# Altium project NANORACK_LASER.PrjPcb
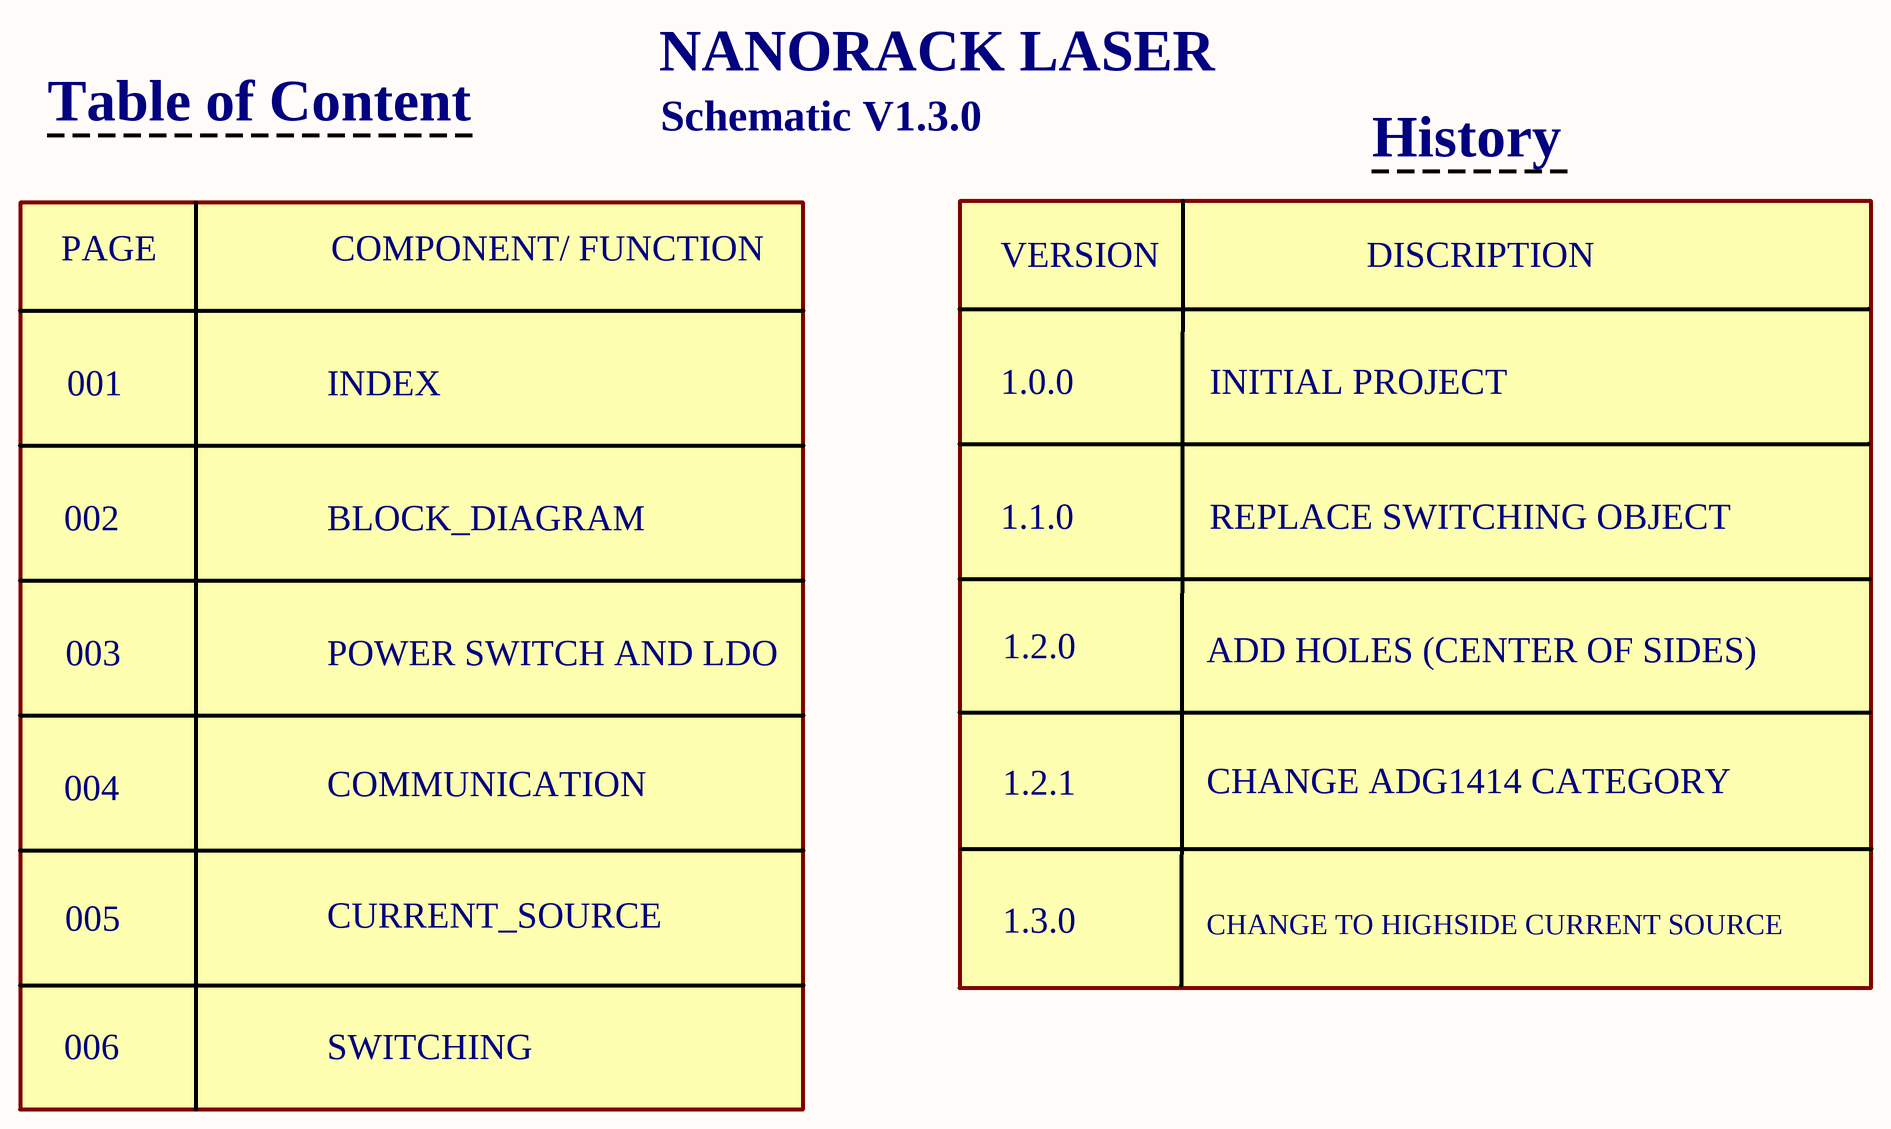
[diagram p0: INDEX.SchDoc]
6 sheets, 200 parts. Net scope: global (net labels, ports and power ports of the same name join across sheets).
Board files: LASERDIODE_V1.3.0.PcbDoc, REFERENCE.PcbDoc
Sheets:
  INDEX.SchDoc
  BLOCK_DIAGRAM.SchDoc
  POWER SWITCH AND LDO.SchDoc
  COMMUNICATION.SchDoc
  CURRENT_SOURCE.SchDoc
  SWITCHING.SchDoc

## Sheet INDEX.SchDoc
size 420 x 297 mm; SheetNumber: 1; SheetTotal: 6

### Notes on the sheet
- NANORACK LASER
- Table of Content
- Schematic V1.3.0
- History
- PAGE
- COMPONENT/ FUNCTION
- VERSION
- DISCRIPTION
- 001
- INDEX
- 1.0.0
- INITIAL PROJECT
- 002
- BLOCK_DIAGRAM
- 1.1.0
- REPLACE SWITCHING OBJECT
- 003
- POWER SWITCH AND LDO
- 1.2.0
- ADD HOLES (CENTER OF SIDES)
- 004
- COMMUNICATION
- 1.2.1
- CHANGE ADG1414 CATEGORY
- 005
- CURRENT_SOURCE
- 1.3.0
- CHANGE TO HIGHSIDE CURRENT SOURCE
- 006
- SWITCHING
- Project:
- BEE-PC1
- Sub-system:
- Design by:
- Hung Nguyen D.
- Bao Bui Q.
- Sheet title:
- Sheet
- A3
- of
- Checked by:
- Approved by:
- Vu Pham
- Revision:
- Document No:
- V1.3.0
- Size:
- Date:

## Sheet BLOCK_DIAGRAM.SchDoc
size 420 x 297 mm; SheetNumber: 2; SheetTotal: 6

### Notes on the sheet
- Project:
- BEE-PC1
- Sub-system:
- Design by:
- Hung Nguyen D.
- Bao Bui Q.
- Sheet title:
- Sheet
- A3
- of
- Checked by:
- Approved by:
- Vu Pham
- Revision:
- Document No:
- V1.3.0
- Size:
- Date:
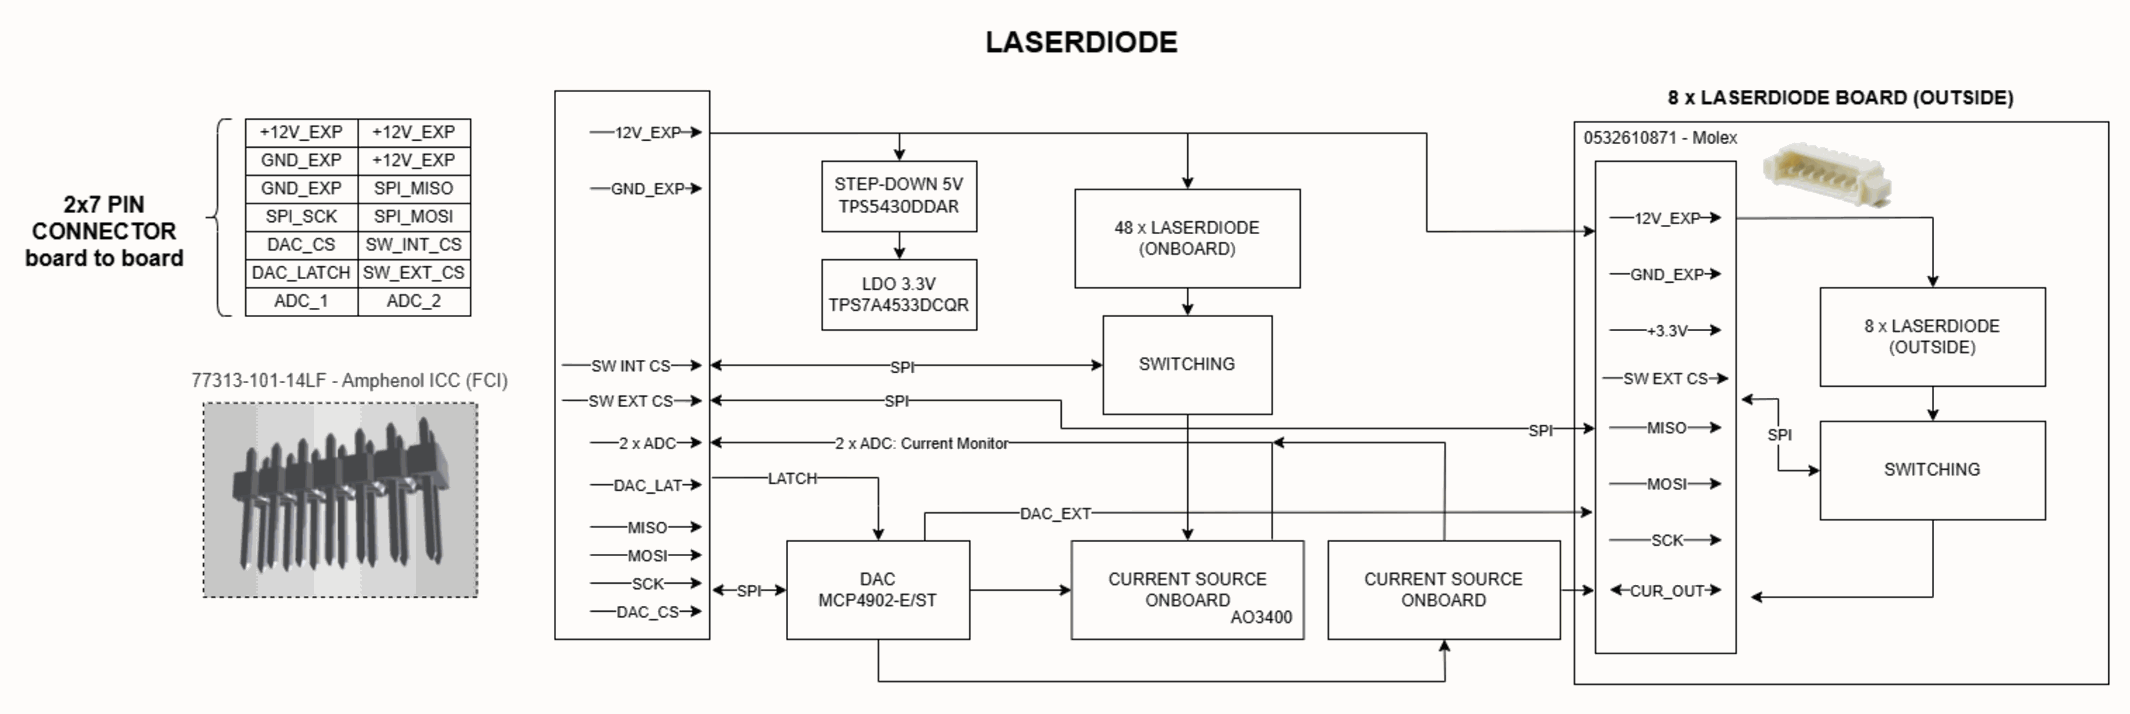
[diagram p1: BLOCK_DIAGRAM.SchDoc]

## Sheet POWER SWITCH AND LDO.SchDoc
size 420 x 297 mm; SheetNumber: 3; SheetTotal: 6
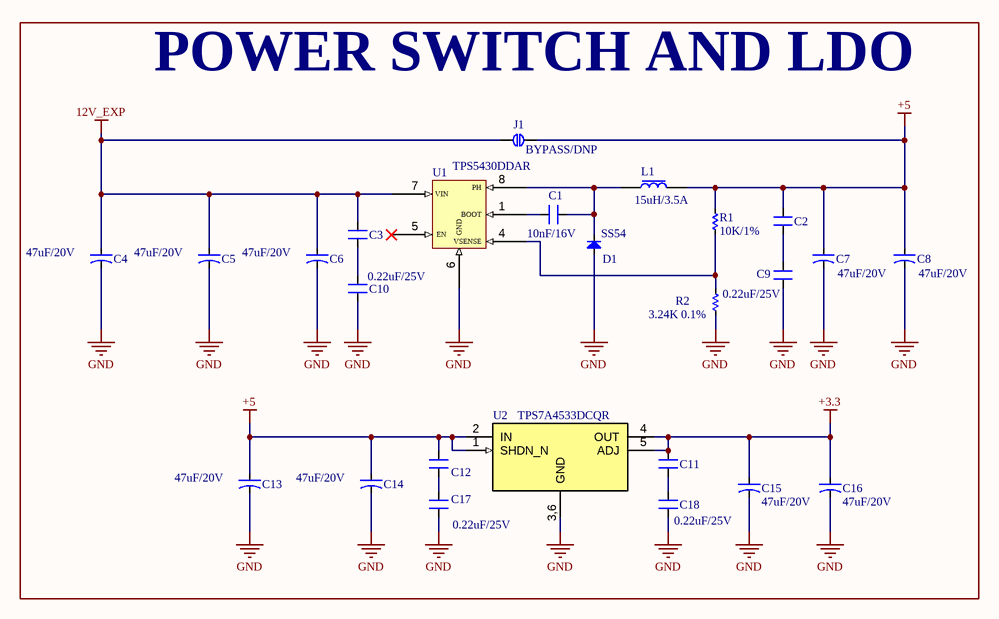
[diagram p2: POWER SWITCH AND LDO.SchDoc]

### Parts
C1  10nF/16V  [SM-0603]
C2  0.22uF/25V  [SM-0603]  (value not drawn)
C3  0.22uF/25V  [SM-0603]  (value not drawn)
C4  47uF/20V  [CAP TANT 2312]
C5  47uF/20V  [CAP TANT 2312]
C6  47uF/20V  [CAP TANT 2312]
C7  47uF/20V  [CAP TANT 2312]
C8  47uF/20V  [CAP TANT 2312]
C9  0.22uF/25V  [SM-0603]
C10  0.22uF/25V  [SM-0603]
C11  0.22uF/25V  [SM-0603]  (value not drawn)
C12  0.22uF/25V  [SM-0603]
C13  47uF/20V  [CAP TANT 2312]
C14  47uF/20V  [CAP TANT 2312]
C15  47uF/20V  [CAP TANT 2312]
C16  47uF/20V  [CAP TANT 2312]
C17  0.22uF/25V  [SM-0603]  (value not drawn)
C18  0.22uF/25V  [SM-0603]
D1  SS54  [DIO-SMD-A]
J1  BYPASS/DNP  [BIG_CONNECTOR]
L1  15uH/3.5A  [SRP7050TA]
R1  10K/1%  [RES-SMD-0603]
R2  3.24K 0.1%  [RES-SMD-0603]
U1  TPS5430DDAR  [HSOP8]
U2  TPS7A4533DCQR  [SOT223-6]

### Blocks framed on the sheet
POWER SWITCH AND LDO: C1-C18 D1 J1 L1 R1 R2 U1 U2

### Nets
12V_EXP: C3.2 C4.1 C5.1 C6.1 J1.1 U1.7(VIN)
+3.3: C11.2 C15.1 C16.1 U2.4(OUT) U2.5(ADJ)
+5: C2.2 C7.1 C8.1 C12.2 C13.1 C14.1 J1.2 L1.2 R1.2 U2.1(SHDN_N) U2.2(IN)
GND: C4.2 C5.2 C6.2 C7.2 C8.2 C9.1 C10.1 C13.2 C14.2 C15.2 C16.2 C17.1 C18.1 D1.1(A) R2.1 U1.6(GND) U2.3,6(GND)
NetC1_1: C1.1 D1.2(K) L1.1 U1.8(PH)
NetC1_2: C1.2 U1.1(BOOT)
NetC2_1: C2.1 C9.2
NetC3_1: C3.1 C10.2
NetC11_1: C11.1 C18.2
NetC12_1: C12.1 C17.2
NetR1_1: R1.1 R2.2 U1.4(VSENSE)

Not connected (* = marked no-connect by the designer): U1 5(EN)*

### Notes on the sheet
- Project:
- BEE-PC1
- Sub-system:
- Design by:
- Hung Nguyen D.
- Bao Bui Q.
- Sheet title:
- Sheet
- A3
- of
- Checked by:
- Approved by:
- Vu Pham
- Revision:
- Document No:
- V1.3.0
- Size:
- Date:

### Library data of the parts
C1 = CM: CL10B103KB8NNNC; Value: 103
C2 C3 C9-C12 C17 C18 = CM: CL10B224KA8NNNC; Value: 103
C4-C8 C13-C16 = CN-ALU-SMD: TAJC476K020RNJ; Published: 8-Jun-2000; LatestRevisionDate: 17-Jul-2002; LatestRevisionNote: Re-released for DXP Platform.; PackageReference: POLAR0.8; Publisher: Altium Limited
D1 = Diode SMD: Code - JEDEC: DO-214-AB; Value: 1N5007; Published: 8-Jun-2000; Revision: July-2002: Re-released for DXP Platform.; Publisher: Altium Limited
J1 = CNT: DNP
L1 = INDUCTOR: SRP7050TA-150M
R1 = Res-SMD: ERJ-3EKF1002V; Manufacturer: Generic Components; Class: Passive; Published: 08/06/2000; Publisher: Altium Hobart Technology Centre
R2 = Res-SMD: ERJ-3EKF3241V; Manufacturer: Generic Components; Class: Passive; Published: 08/06/2000; Publisher: Altium Hobart Technology Centre
U1 = TPS543X: pin to pad: 6>6+9

## Sheet COMMUNICATION.SchDoc
size 420 x 297 mm; SheetNumber: 4; SheetTotal: 6
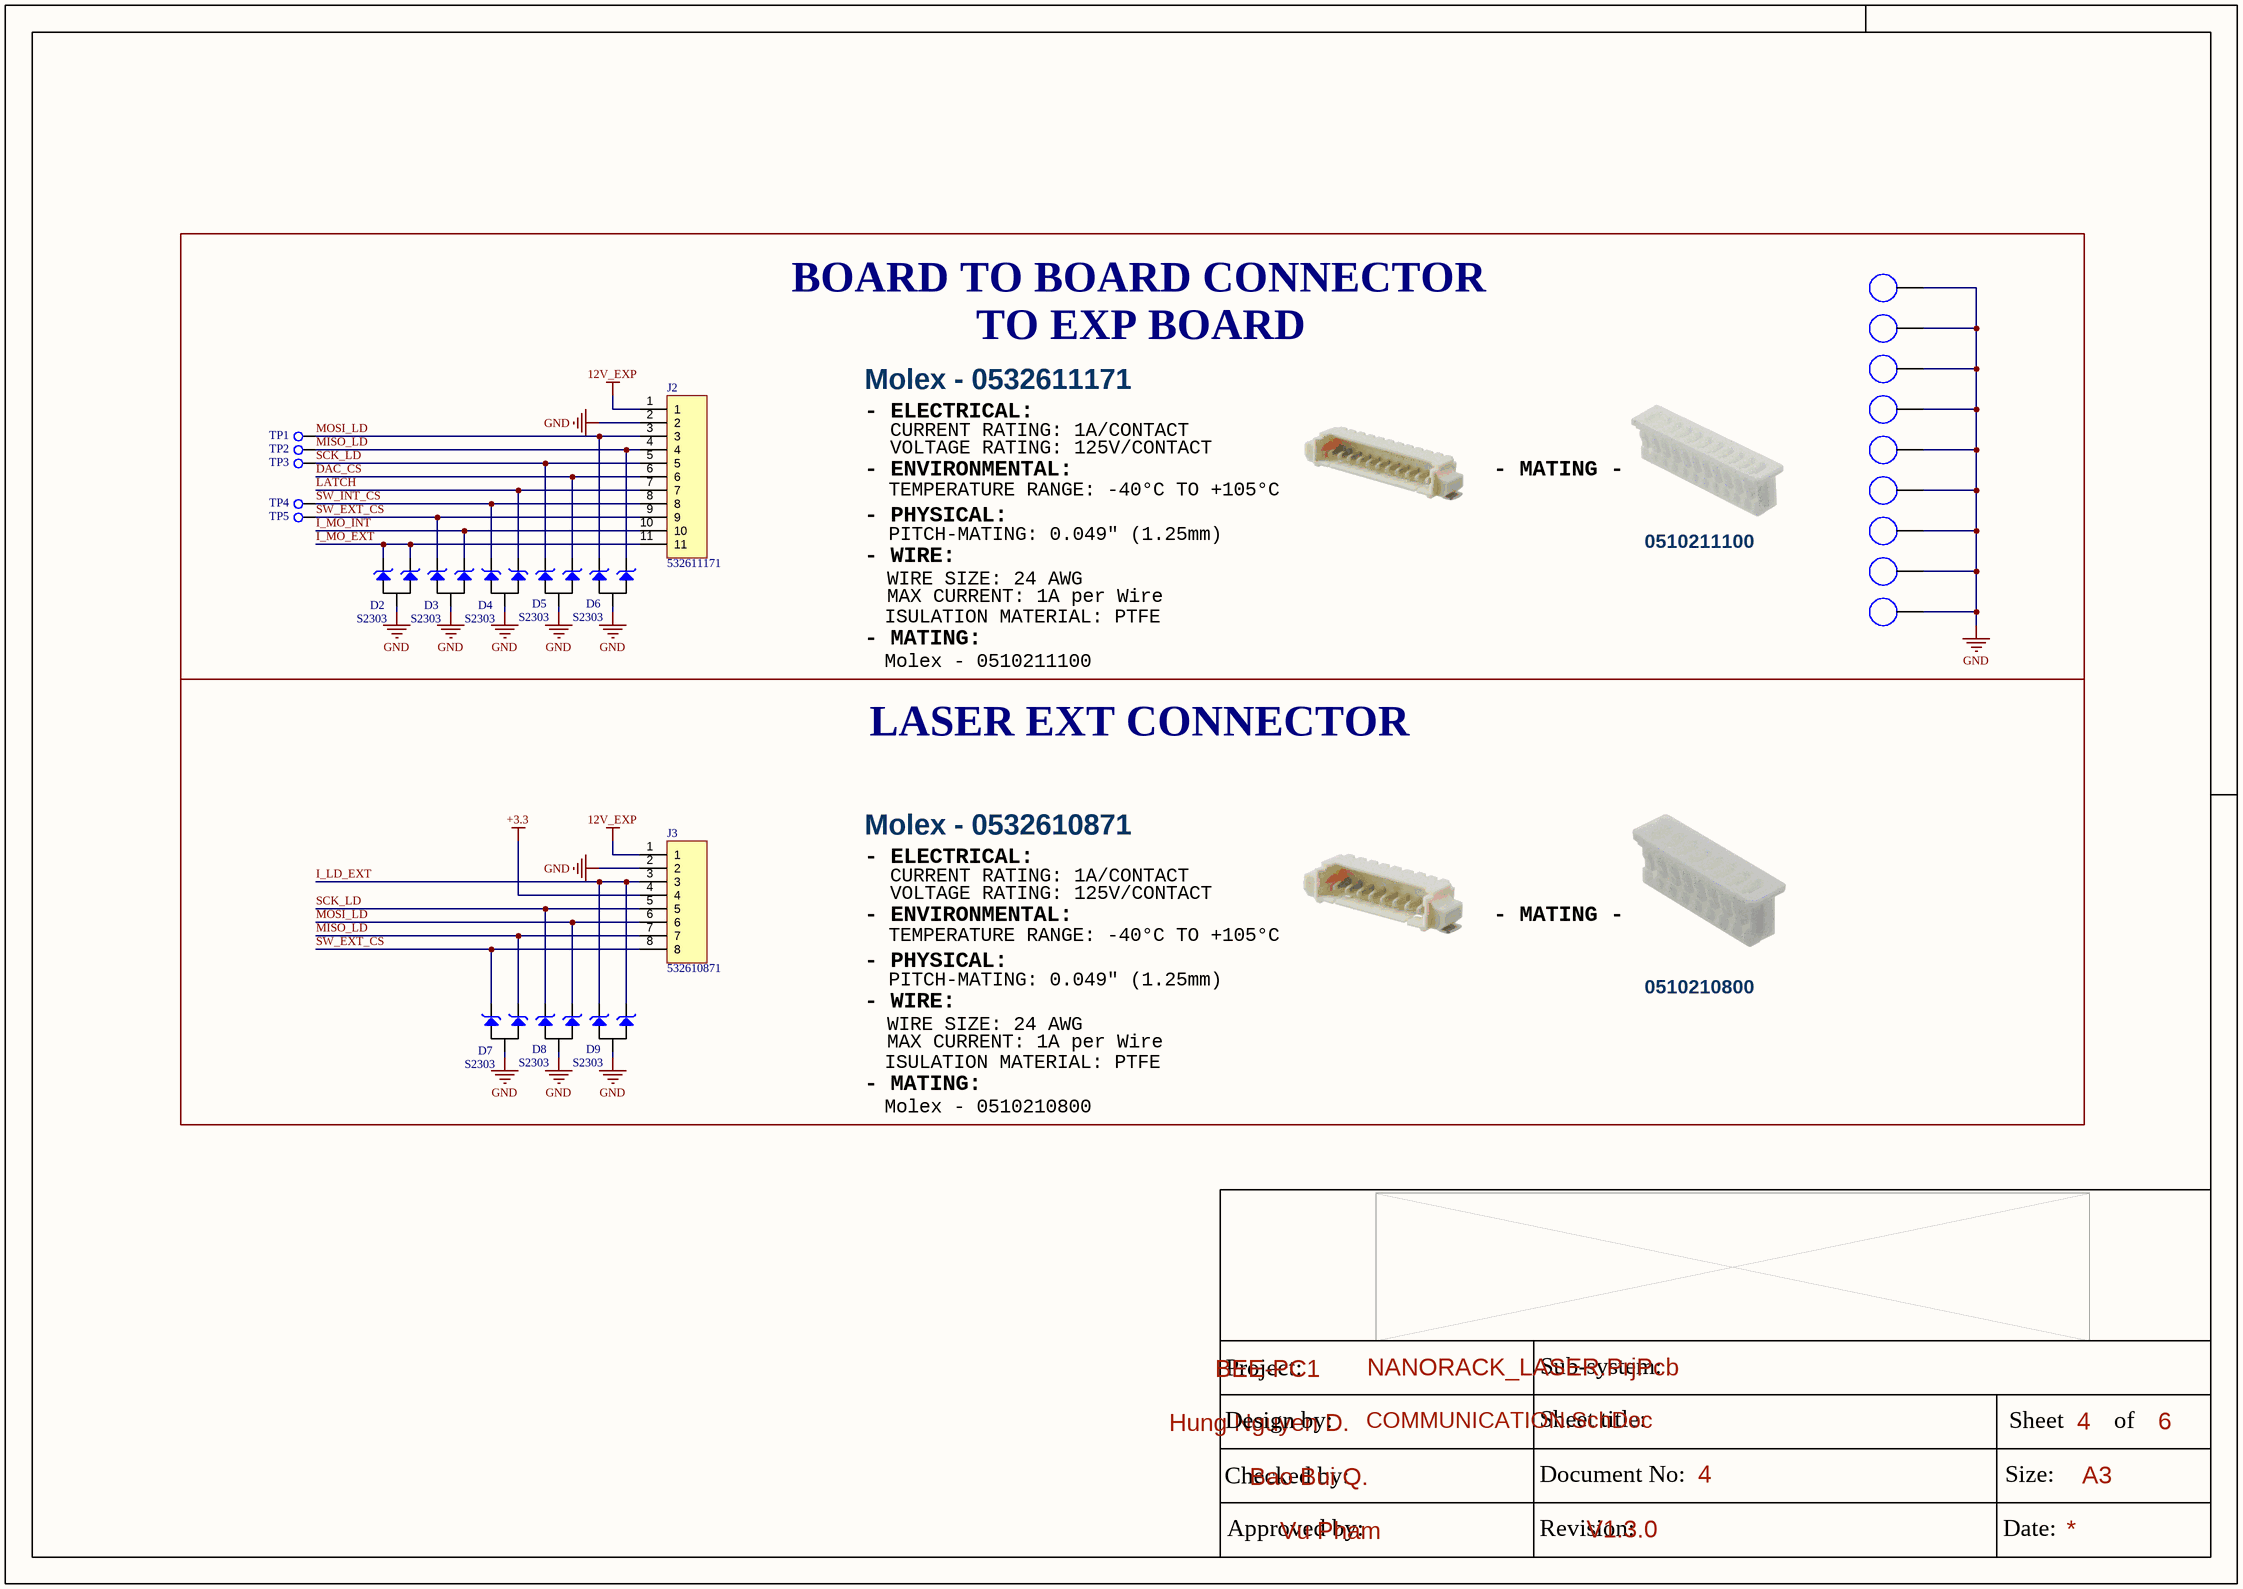
[diagram p3: COMMUNICATION.SchDoc]

### Parts
D2  S2303  [SOT23-123]
D3  S2303  [SOT23-123]
D4  S2303  [SOT23-123]
D5  S2303  [SOT23-123]
D6  S2303  [SOT23-123]
D7  S2303  [SOT23-123]
D8  S2303  [SOT23-123]
D9  S2303  [SOT23-123]
H1  HOLD  [M3]  (value not drawn)
H2  HOLD  [M3]  (value not drawn)
H3  HOLD  [M3]  (value not drawn)
H4  HOLD  [M3]  (value not drawn)
H5  HOLD  [M3]  (value not drawn)
H6  HOLD  [M3]  (value not drawn)
H7  HOLD  [M3]  (value not drawn)
H8  HOLD  [M3]  (value not drawn)
H9  HOLD  [M3]  (value not drawn)
J2  532611171  [MOLEX_532611171]
J3  532610871  [MOLEX_532610001]
TP1  Test_Point  [TESTPOINT]  (value not drawn)
TP2  Test_Point  [TESTPOINT]  (value not drawn)
TP3  Test_Point  [TESTPOINT]  (value not drawn)
TP4  Test_Point  [TESTPOINT]  (value not drawn)
TP5  Test_Point  [TESTPOINT]  (value not drawn)

### Blocks framed on the sheet
LASER EXT CONNECTOR: D7-D9 J3

### Nets
12V_EXP: J2.1 J3.1
+3.3: J3.4
GND: D2.2 D3.2 D4.2 D5.2 D6.2 D7.2 D8.2 D9.2 H1.1 H2.1 H3.1 H4.1 H5.1 H6.1 H7.1 H8.1 H9.1 J2.2 J3.2
I_LD_EXT: D9.1 D9.3 J3.3
DAC_CS: D5.3 J2.6
I_MO_EXT: D2.1 D2.3 J2.11
I_MO_INT: D3.3 J2.10
LATCH: D4.1 J2.7
MISO_LD: D6.3 D7.1 J2.4 J3.7 TP2.1
MOSI_LD: D6.1 D8.3 J2.3 J3.6 TP1.1
SCK_LD: D5.1 D8.1 J2.5 J3.5 TP3.1
SW_EXT_CS: D3.1 D7.3 J2.9 J3.8 TP5.1
SW_INT_CS: D4.3 J2.8 TP4.1

### Notes on the sheet
- BOARD TO BOARD CONNECTOR
- Molex - 0532611171
- TO EXP BOARD
- - ELECTRICAL:
- CURRENT RATING: 1A/CONTACT
- VOLTAGE RATING: 125V/CONTACT
- - ENVIRONMENTAL:
- - PHYSICAL:
- TEMPERATURE RANGE: -40°C TO +105°C
- - MATING -
- - WIRE:
- WIRE SIZE: 24 AWG
- PITCH-MATING: 0.049" (1.25mm)
- 0510211100
- - MATING:
- ISULATION MATERIAL: PTFE
- Molex - 0510211100
- MAX CURRENT: 1A per Wire
- Molex - 0532610871
- 0510210800
- Molex - 0510210800
- Project:
- BEE-PC1
- Sub-system:
- Design by:
- Hung Nguyen D.
- Bao Bui Q.
- Sheet title:
- Sheet
- A3
- of
- Checked by:
- Approved by:
- Vu Pham
- Revision:
- Document No:
- V1.3.0
- Size:
- Date:

### Library data of the parts
H1-H9 = PAD_HOLD
J2 = 532611171: Manufacturer_Name: Molex Connector Corporation; Copyright: Copyright (C) 2025 Ultra Librarian. All rights reserved.; Manufacturer_Part_Number: 532611171; Datasheet: https://www.molex.com/en-us/products/part-detail-pdf/532611171?display=pdf; RefDes: RefDes; Type: Type
J3 = 532610871: Manufacturer_Name: Molex Connector Corporation; Copyright: Copyright (C) 2025 Ultra Librarian. All rights reserved.; Manufacturer_Part_Number: 532610871; Datasheet: https://www.molex.com/en-us/products/part-detail-pdf/532610871?display=pdf; RefDes: RefDes; Type: Type

## Sheet CURRENT_SOURCE.SchDoc
size 420 x 297 mm; SheetNumber: 5; SheetTotal: 6
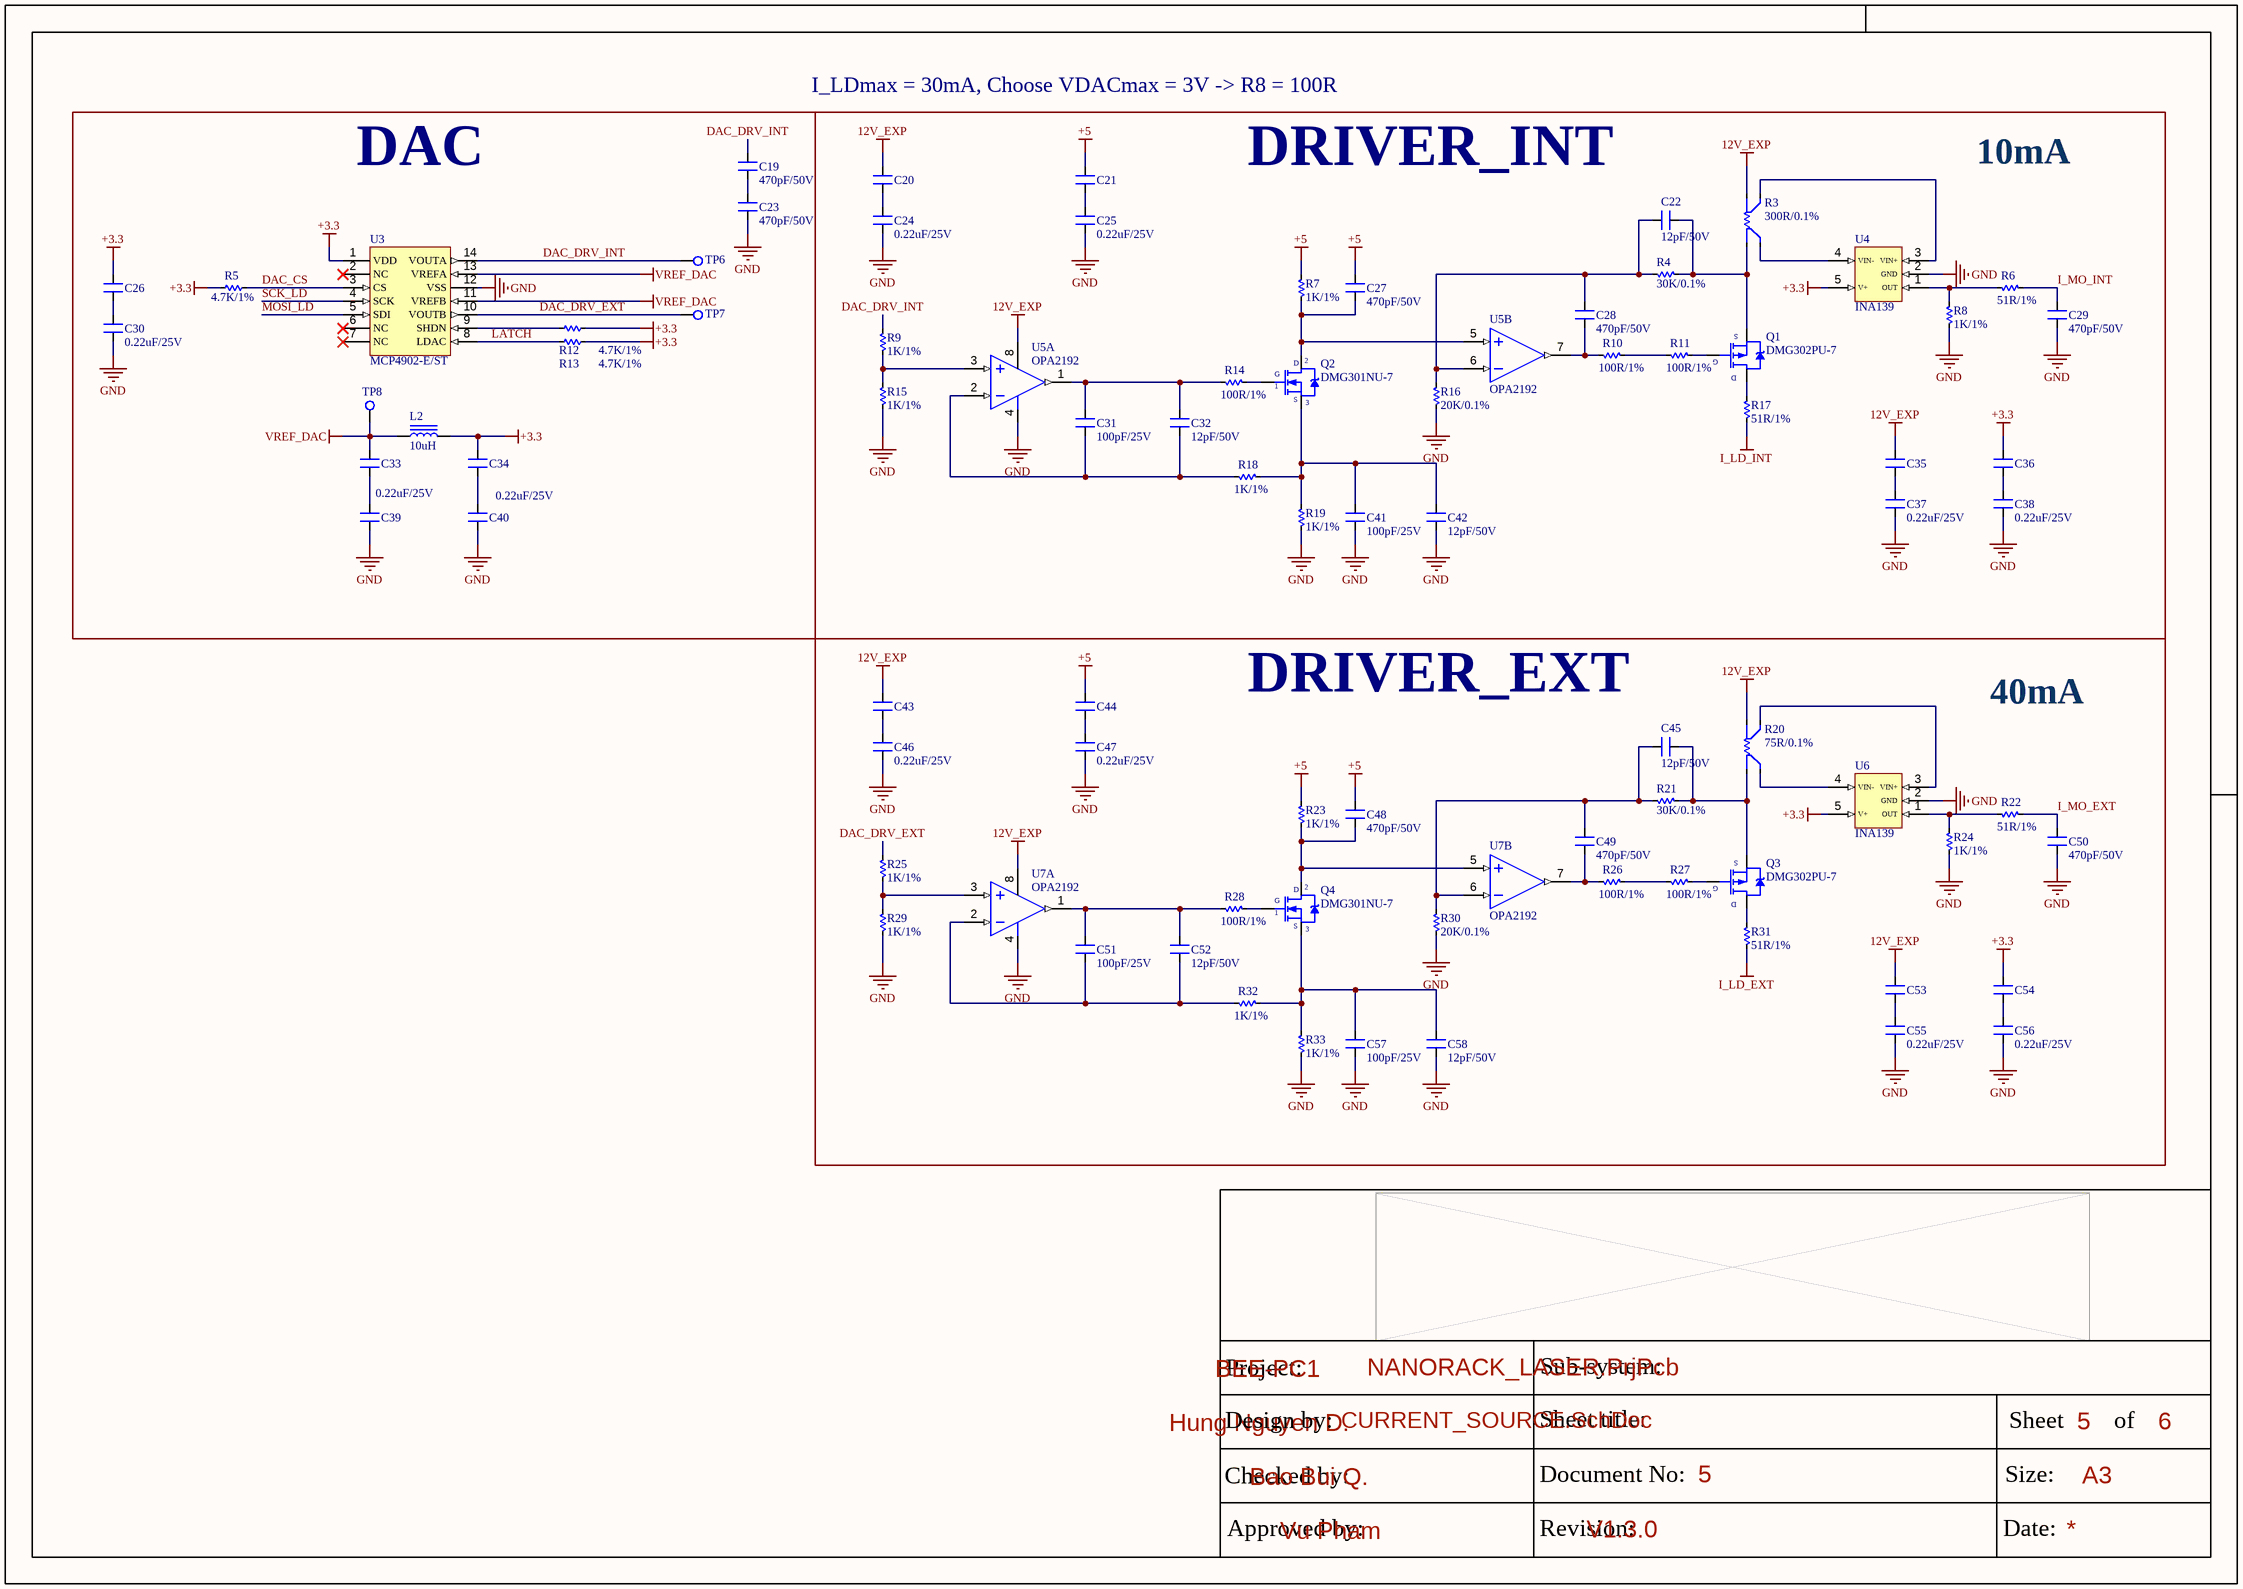
[diagram p4: CURRENT_SOURCE.SchDoc]

### Parts
C19  470pF/50V  [SM-0603]
C20  0.22uF/25V  [SM-0603]  (value not drawn)
C21  0.22uF/25V  [SM-0603]  (value not drawn)
C22  12pF/50V  [SM-0603]
C23  470pF/50V  [SM-0603]
C24  0.22uF/25V  [SM-0603]
C25  0.22uF/25V  [SM-0603]
C26  0.22uF/25V  [SM-0603]  (value not drawn)
C27  470pF/50V  [SM-0603]
C28  470pF/50V  [SM-0603]
C29  470pF/50V  [SM-0603]
C30  0.22uF/25V  [SM-0603]
C31  100pF/25V  [SM-0603]
C32  12pF/50V  [SM-0603]
C33  0.22uF/25V  [SM-0603]  (value not drawn)
C34  0.22uF/25V  [SM-0603]  (value not drawn)
C35  0.22uF/25V  [SM-0603]  (value not drawn)
C36  0.22uF/25V  [SM-0603]  (value not drawn)
C37  0.22uF/25V  [SM-0603]
C38  0.22uF/25V  [SM-0603]
C39  0.22uF/25V  [SM-0603]
C40  0.22uF/25V  [SM-0603]
C41  100pF/25V  [SM-0603]
C42  12pF/50V  [SM-0603]
C43  0.22uF/25V  [SM-0603]  (value not drawn)
C44  0.22uF/25V  [SM-0603]  (value not drawn)
C45  12pF/50V  [SM-0603]
C46  0.22uF/25V  [SM-0603]
C47  0.22uF/25V  [SM-0603]
C48  470pF/50V  [SM-0603]
C49  470pF/50V  [SM-0603]
C50  470pF/50V  [SM-0603]
C51  100pF/25V  [SM-0603]
C52  12pF/50V  [SM-0603]
C53  0.22uF/25V  [SM-0603]  (value not drawn)
C54  0.22uF/25V  [SM-0603]  (value not drawn)
C55  0.22uF/25V  [SM-0603]
C56  0.22uF/25V  [SM-0603]
C57  100pF/25V  [SM-0603]
C58  12pF/50V  [SM-0603]
L2  10uH  [FER 0805/2012]
Q1  DMG302PU-7  [SOT23-3-132]
Q2  DMG301NU-7  [SOT23-3-132]
Q3  DMG302PU-7  [SOT23-3-132]
Q4  DMG301NU-7  [SOT23-3-132]
R3  300R/0.1%  [RES_SMD_0603_SHUNT]
R4  30K/0.1%  [RES-SMD-0603]
R5  4.7K/1%  [RES-SMD-0603]
R6  51R/1%  [RES-SMD-0603]
R7  1K/1%  [RES-SMD-0603]
R8  1K/1%  [RES-SMD-0603]
R9  1K/1%  [RES-SMD-0603]
R10  100R/1%  [RES-SMD-0603]
R11  100R/1%  [RES-SMD-0603]
R12  4.7K/1%  [RES-SMD-0603]
R13  4.7K/1%  [RES-SMD-0603]
R14  100R/1%  [RES-SMD-0603]
R15  1K/1%  [RES-SMD-0603]
R16  20K/0.1%  [RES-SMD-0603]
R17  51R/1%  [RES-SMD-0603]
R18  1K/1%  [RES-SMD-0603]
R19  1K/1%  [RES-SMD-0603]
R20  75R/0.1%  [RES_SMD_0603_SHUNT]
R21  30K/0.1%  [RES-SMD-0603]
R22  51R/1%  [RES-SMD-0603]
R23  1K/1%  [RES-SMD-0603]
R24  1K/1%  [RES-SMD-0603]
R25  1K/1%  [RES-SMD-0603]
R26  100R/1%  [RES-SMD-0603]
R27  100R/1%  [RES-SMD-0603]
R28  100R/1%  [RES-SMD-0603]
R29  1K/1%  [RES-SMD-0603]
R30  20K/0.1%  [RES-SMD-0603]
R31  51R/1%  [RES-SMD-0603]
R32  1K/1%  [RES-SMD-0603]
R33  1K/1%  [RES-SMD-0603]
TP6  Test_Point  [TESTPOINT]  (value not drawn)
TP7  Test_Point  [TESTPOINT]  (value not drawn)
TP8  Test_Point  [TESTPOINT]  (value not drawn)
U3  MCP4902-E/ST  [TSSOP14]
U4  INA139  [SOT23-5]
U5  OPA2192  [SO8]  (parts A,B of 2)
U6  INA139  [SOT23-5]
U7  OPA2192  [SO8]  (parts A,B of 2)

### Blocks framed on the sheet
DAC: C19 C23 C26 C30 C33 C34 C39 C40 L2 R5 R12 R13 TP6-TP8 U3
DRIVER_INT: C20-C22 C24 C25 C27-C29 C31 C32 C35-C38 C41 C42 Q1 Q2 R3 R4 R6-R11 R14-R19 U4 U5
DRIVER_EXT: C43-C58 Q3 Q4 R20-R33 U6 U7

### Nets
12V_EXP: C20.2 C35.2 C43.2 C53.2 R3.1 R20.1 U5.8(+V) U7.8(+V)
+3.3: C26.2 C34.2 C36.2 C54.2 L2.2 R5.2 R12.1 R13.1 U3.1(VDD) U4.5(V+) U6.5(V+)
+5: C21.2 C27.2 C44.2 C48.2 R7.2 R23.2
GND: C23.1 C24.1 C25.1 C29.1 C30.1 C37.1 C38.1 C39.1 C40.1 C41.1 C42.2 C46.1 C47.1 C50.1 C55.1 C56.1 C57.1 C58.2 R8.2 R15.1 R16.1 R19.1 R24.2 R29.1 R30.1 R33.1 U3.12(VSS) U4.2(GND) U5.4(-V) U6.2(GND) U7.4(-V)
I_LD_EXT: R31.1
I_LD_INT: R17.1
VREF_DAC: C33.2 L2.1 TP8.1 U3.11(VREFB) U3.13(VREFA)
DAC_CS: R5.1 U3.3(CS)
DAC_DRV_EXT: R25.2 TP7.1 U3.10(VOUTB)
DAC_DRV_INT: C19.2 R9.2 TP6.1 U3.14(VOUTA)
I_MO_EXT: C50.2 R22.2
I_MO_INT: C29.2 R6.2
LATCH: R13.2 U3.8(LDAC)
MOSI_LD: U3.5(SDI)
SCK_LD: U3.4(SCK)
NetC19_1: C19.1 C23.2
NetC20_1: C20.1 C24.2
NetC21_1: C21.1 C25.2
NetC22_1: C22.1 Q1.3(S) R3.2 R4.1
NetC22_2: C22.2 C28.2 R4.2 R16.2 U5.6(IN-)
NetC26_1: C26.1 C30.2
NetC27_1: C27.1 Q2.2(D) R7.1 U5.5(IN+)
NetC28_1: C28.1 R10.1 U5.7(OUT)
NetC31_1: C31.1 C32.1 R18.1 U5.2(IN-)
NetC31_2: C31.2 C32.2 R14.1 U5.1(OUT)
NetC33_1: C33.1 C39.2
NetC34_1: C34.1 C40.2
NetC35_1: C35.1 C37.2
NetC36_1: C36.1 C38.2
NetC41_2: C41.2 C42.1 Q2.3(S) R18.2 R19.2
NetC43_1: C43.1 C46.2
NetC44_1: C44.1 C47.2
NetC45_1: C45.1 Q3.3(S) R20.2 R21.1
NetC45_2: C45.2 C49.2 R21.2 R30.2 U7.6(IN-)
NetC48_1: C48.1 Q4.2(D) R23.1 U7.5(IN+)
NetC49_1: C49.1 R26.1 U7.7(OUT)
NetC51_1: C51.1 C52.1 R32.1 U7.2(IN-)
NetC51_2: C51.2 C52.2 R28.1 U7.1(OUT)
NetC53_1: C53.1 C55.2
NetC54_1: C54.1 C56.2
NetC57_2: C57.2 C58.1 Q4.3(S) R32.2 R33.2
NetQ1_1: Q1.1(G) R11.2
NetQ1_2: Q1.2(D) R17.2
NetQ2_1: Q2.1(G) R14.2
NetQ3_1: Q3.1(G) R27.2
NetQ3_2: Q3.2(D) R31.2
NetQ4_1: Q4.1(G) R28.2
NetR3_3: R3.3 U4.3(VIN+)
NetR3_4: R3.4 U4.4(VIN-)
NetR6_1: R6.1 R8.1 U4.1(OUT)
NetR9_1: R9.1 R15.2 U5.3(IN+)
NetR10_2: R10.2 R11.1
NetR12_2: R12.2 U3.9(SHDN)
NetR20_3: R20.3 U6.3(VIN+)
NetR20_4: R20.4 U6.4(VIN-)
NetR22_1: R22.1 R24.1 U6.1(OUT)
NetR25_1: R25.1 R29.2 U7.3(IN+)
NetR26_2: R26.2 R27.1

Not connected (* = marked no-connect by the designer): U3 2(NC)* 6(NC)* 7(NC)*

### Notes on the sheet
- I_LDmax = 30mA, Choose VDACmax = 3V -> R8 = 100R
- 10mA
- 40mA
- Project:
- BEE-PC1
- Sub-system:
- Design by:
- Hung Nguyen D.
- Bao Bui Q.
- Sheet title:
- Sheet
- A3
- of
- Checked by:
- Approved by:
- Vu Pham
- Revision:
- Document No:
- V1.3.0
- Size:
- Date:

### Library data of the parts
C19 C23 C27-C29 C48-C50 = CM: CL10B471KB8NNNC; Value: 103
C20 C21 C24-C26 C30 C33-C40 C43 C44 C46 C47 C53-C56 = CM: CL10B224KA8NNNC; Value: 103
C22 C32 C42 C45 C52 C58 = CM: CL10C120JB81PNC; Value: 103
C31 C41 C51 C57 = CM: C0603C101M3HACTU; Value: 103
L2 = Inductor: MLZ1608N100LT000; Value: 1.5uH
Q1 Q3 = P_MOSFET
Q2 Q4 = N_MOSFET
R3 = RES_SMD_SHUNT: RT0603BRC07300RL
R4 R21 = Res-SMD: ERA-3AEB303V; Manufacturer: Generic Components; Class: Passive; Published: 08/06/2000; Publisher: Altium Hobart Technology Centre
R5 R12 R13 = Res-SMD: ERJ-3EKF4701V; Manufacturer: Generic Components; Class: Passive; Published: 08/06/2000; Publisher: Altium Hobart Technology Centre
R6 R17 R22 R31 = Res-SMD: ERJ-3EKF51R0V; Manufacturer: Generic Components; Class: Passive; Published: 08/06/2000; Publisher: Altium Hobart Technology Centre
R7-R9 R15 R18 R19 R23-R25 R29 R32 R33 = Res-SMD: ERJ-3EKF1001V; Manufacturer: Generic Components; Class: Passive; Published: 08/06/2000; Publisher: Altium Hobart Technology Centre
R10 R11 R14 R26-R28 = Res-SMD: ERJ-PA3D1000V; Manufacturer: Generic Components; Class: Passive; Published: 08/06/2000; Publisher: Altium Hobart Technology Centre
R16 R30 = Res-SMD: ERA-3AEB203V; Manufacturer: Generic Components; Class: Passive; Published: 08/06/2000; Publisher: Altium Hobart Technology Centre
R20 = RES_SMD_SHUNT: TNPW060375R0BEEA
U3 = MCP4902
U4 U6 = INA139: INA139NA/250
U5 U7 = LM358: OPA2192IDR; Value: LM358

## Sheet SWITCHING.SchDoc
size 420 x 297 mm; SheetNumber: 6; SheetTotal: 6
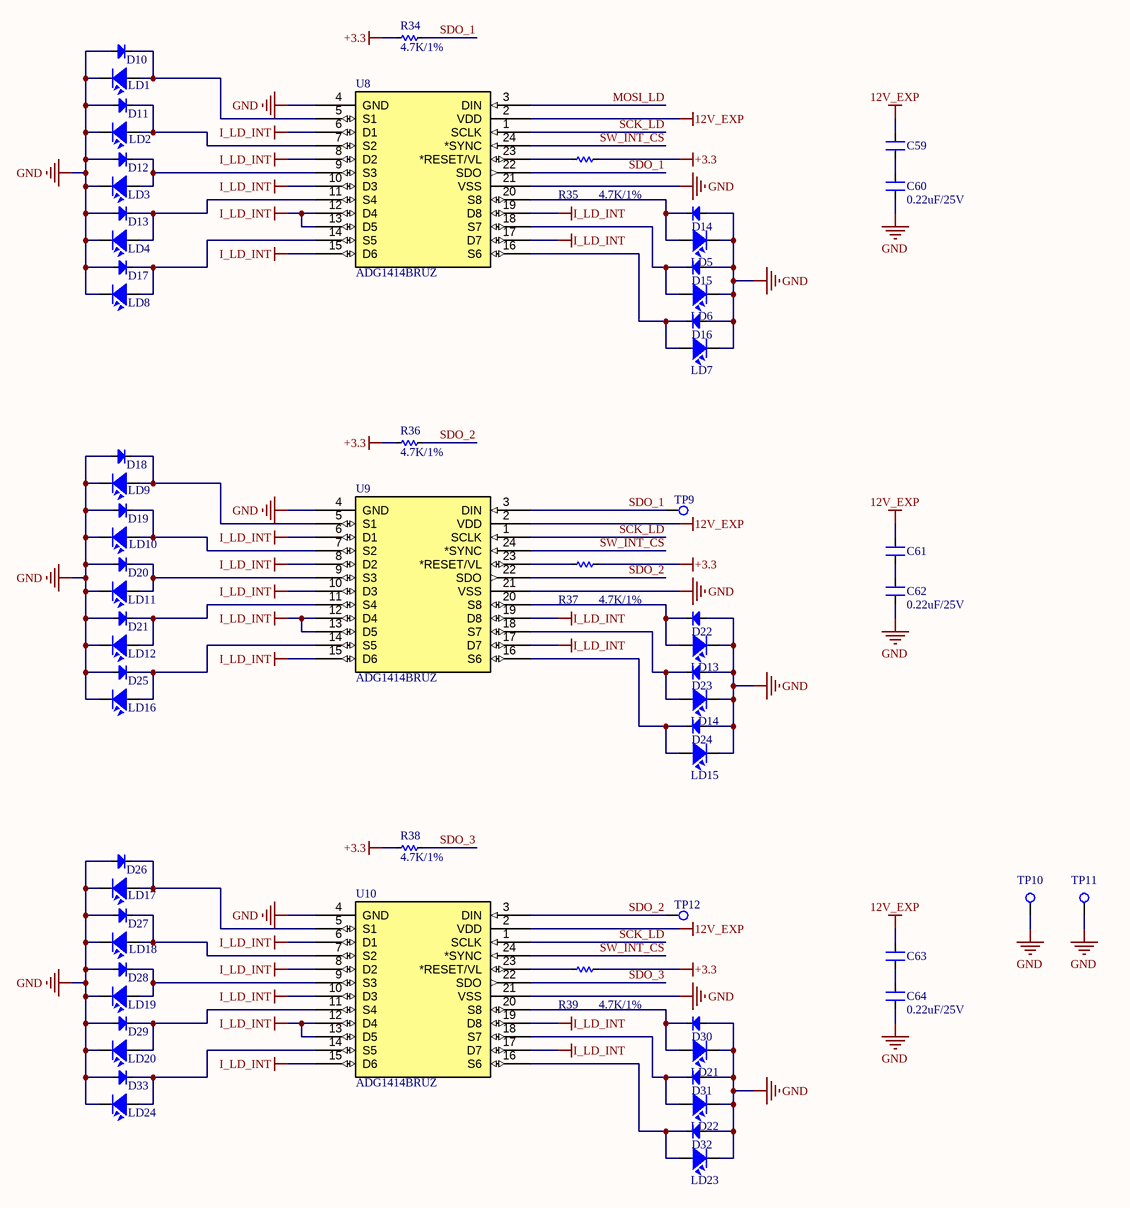
[diagram p5: SWITCHING.SchDoc]

### Parts
C59  0.22uF/25V  [SM-0603]  (value not drawn)
C60  0.22uF/25V  [SM-0603]
C61  0.22uF/25V  [SM-0603]  (value not drawn)
C62  0.22uF/25V  [SM-0603]
C63  0.22uF/25V  [SM-0603]  (value not drawn)
C64  0.22uF/25V  [SM-0603]
D10  1N4148W-TP  [SOD23]  (value not drawn)
D11  1N4148W-TP  [SOD23]  (value not drawn)
D12  1N4148W-TP  [SOD23]  (value not drawn)
D13  1N4148W-TP  [SOD23]  (value not drawn)
D14  1N4148W-TP  [SOD23]  (value not drawn)
D15  1N4148W-TP  [SOD23]  (value not drawn)
D16  1N4148W-TP  [SOD23]  (value not drawn)
D17  1N4148W-TP  [SOD23]  (value not drawn)
D18  1N4148W-TP  [SOD23]  (value not drawn)
D19  1N4148W-TP  [SOD23]  (value not drawn)
D20  1N4148W-TP  [SOD23]  (value not drawn)
D21  1N4148W-TP  [SOD23]  (value not drawn)
D22  1N4148W-TP  [SOD23]  (value not drawn)
D23  1N4148W-TP  [SOD23]  (value not drawn)
D24  1N4148W-TP  [SOD23]  (value not drawn)
D25  1N4148W-TP  [SOD23]  (value not drawn)
D26  1N4148W-TP  [SOD23]  (value not drawn)
D27  1N4148W-TP  [SOD23]  (value not drawn)
D28  1N4148W-TP  [SOD23]  (value not drawn)
D29  1N4148W-TP  [SOD23]  (value not drawn)
D30  1N4148W-TP  [SOD23]  (value not drawn)
D31  1N4148W-TP  [SOD23]  (value not drawn)
D32  1N4148W-TP  [SOD23]  (value not drawn)
D33  1N4148W-TP  [SOD23]  (value not drawn)
LD1  LaserDiode  [LASER_SOCKET]  (value not drawn)
LD2  LaserDiode  [LASER_SOCKET]  (value not drawn)
LD3  LaserDiode  [LASER_SOCKET]  (value not drawn)
LD4  LaserDiode  [LASER_SOCKET]  (value not drawn)
LD5  LaserDiode  [LASER_SOCKET]  (value not drawn)
LD6  LaserDiode  [LASER_SOCKET]  (value not drawn)
LD7  LaserDiode  [LASER_SOCKET]  (value not drawn)
LD8  LaserDiode  [LASER_SOCKET]  (value not drawn)
LD9  LaserDiode  [LASER_SOCKET]  (value not drawn)
LD10  LaserDiode  [LASER_SOCKET]  (value not drawn)
LD11  LaserDiode  [LASER_SOCKET]  (value not drawn)
LD12  LaserDiode  [LASER_SOCKET]  (value not drawn)
LD13  LaserDiode  [LASER_SOCKET]  (value not drawn)
LD14  LaserDiode  [LASER_SOCKET]  (value not drawn)
LD15  LaserDiode  [LASER_SOCKET]  (value not drawn)
LD16  LaserDiode  [LASER_SOCKET]  (value not drawn)
LD17  LaserDiode  [LASER_SOCKET]  (value not drawn)
LD18  LaserDiode  [LASER_SOCKET]  (value not drawn)
LD19  LaserDiode  [LASER_SOCKET]  (value not drawn)
LD20  LaserDiode  [LASER_SOCKET]  (value not drawn)
LD21  LaserDiode  [LASER_SOCKET]  (value not drawn)
LD22  LaserDiode  [LASER_SOCKET]  (value not drawn)
LD23  LaserDiode  [LASER_SOCKET]  (value not drawn)
LD24  LaserDiode  [LASER_SOCKET]  (value not drawn)
R34  4.7K/1%  [RES-SMD-0603]
R35  4.7K/1%  [RES-SMD-0603]
R36  4.7K/1%  [RES-SMD-0603]
R37  4.7K/1%  [RES-SMD-0603]
R38  4.7K/1%  [RES-SMD-0603]
R39  4.7K/1%  [RES-SMD-0603]
TP9  Test_Point  [TESTPOINT]  (value not drawn)
TP10  Test_Point  [TESTPOINT]  (value not drawn)
TP11  Test_Point  [TESTPOINT]  (value not drawn)
TP12  Test_Point  [TESTPOINT]  (value not drawn)
U8  ADG1414BRUZ  [TSSOP24]
U9  ADG1414BRUZ  [TSSOP24]
U10  ADG1414BRUZ  [TSSOP24]

### Nets
12V_EXP: C59.2 C61.2 C63.2 U8.2(VDD) U9.2(VDD) U10.2(VDD)
+3.3: R34.2 R35.2 R36.2 R37.2 R38.2 R39.2
GND: C60.1 C62.1 C64.1 D10.1(A) D11.1(A) D12.1(A) D13.1(A) D14.1(A) D15.1(A) D16.1(A) D17.1(A) D18.1(A) D19.1(A) D20.1(A) D21.1(A) D22.1(A) D23.1(A) D24.1(A) D25.1(A) D26.1(A) D27.1(A) D28.1(A) D29.1(A) D30.1(A) D31.1(A) D32.1(A) D33.1(A) LD1.3 LD2.3 LD3.3 LD4.3 LD5.3 LD6.3 LD7.3 LD8.3 LD9.3 LD10.3 LD11.3 LD12.3 LD13.3 LD14.3 LD15.3 LD16.3 LD17.3 LD18.3 LD19.3 LD20.3 LD21.3 LD22.3 LD23.3 LD24.3 TP10.1 TP11.1 U8.4(GND) U8.21(VSS) U9.4(GND) U9.21(VSS) U10.4(GND) U10.21(VSS)
I_LD_INT: U8.6(D1) U8.8(D2) U8.10(D3) U8.12(D4) U8.13(D5) U8.15(D6) U8.17(D7) U8.19(D8) U9.6(D1) U9.8(D2) U9.10(D3) U9.12(D4) U9.13(D5) U9.15(D6) U9.17(D7) U9.19(D8) U10.6(D1) U10.8(D2) U10.10(D3) U10.12(D4) U10.13(D5) U10.15(D6) U10.17(D7) U10.19(D8)
MOSI_LD: U8.3(DIN)
SCK_LD: U8.1(SCLK) U9.1(SCLK) U10.1(SCLK)
SDO_1: R34.1 TP9.1 U8.22(SDO) U9.3(DIN)
SDO_2: R36.1 TP12.1 U9.22(SDO) U10.3(DIN)
SDO_3: R38.1 U10.22(SDO)
SW_INT_CS: U8.24(*SYNC) U9.24(*SYNC) U10.24(*SYNC)
NetC59_1: C59.1 C60.2
NetC61_1: C61.1 C62.2
NetC63_1: C63.1 C64.2
NetD10_2: D10.2(K) LD1.1 U8.5(S1)
NetD11_2: D11.2(K) LD2.1 U8.7(S2)
NetD12_2: D12.2(K) LD3.1 U8.9(S3)
NetD13_2: D13.2(K) LD4.1 U8.11(S4)
NetD14_2: D14.2(K) LD5.1 U8.20(S8)
NetD15_2: D15.2(K) LD6.1 U8.18(S7)
NetD16_2: D16.2(K) LD7.1 U8.16(S6)
NetD17_2: D17.2(K) LD8.1 U8.14(S5)
NetD18_2: D18.2(K) LD9.1 U9.5(S1)
NetD19_2: D19.2(K) LD10.1 U9.7(S2)
NetD20_2: D20.2(K) LD11.1 U9.9(S3)
NetD21_2: D21.2(K) LD12.1 U9.11(S4)
NetD22_2: D22.2(K) LD13.1 U9.20(S8)
NetD23_2: D23.2(K) LD14.1 U9.18(S7)
NetD24_2: D24.2(K) LD15.1 U9.16(S6)
NetD25_2: D25.2(K) LD16.1 U9.14(S5)
NetD26_2: D26.2(K) LD17.1 U10.5(S1)
NetD27_2: D27.2(K) LD18.1 U10.7(S2)
NetD28_2: D28.2(K) LD19.1 U10.9(S3)
NetD29_2: D29.2(K) LD20.1 U10.11(S4)
NetD30_2: D30.2(K) LD21.1 U10.20(S8)
NetD31_2: D31.2(K) LD22.1 U10.18(S7)
NetD32_2: D32.2(K) LD23.1 U10.16(S6)
NetD33_2: D33.2(K) LD24.1 U10.14(S5)
NetR35_1: R35.1 U8.23(*RESET/VL)
NetR37_1: R37.1 U9.23(*RESET/VL)
NetR39_1: R39.1 U10.23(*RESET/VL)

### Notes on the sheet
- Project:
- BEE-PC1
- Sub-system:
- Design by:
- Hung Nguyen D.
- Bao Bui Q.
- Sheet title:
- Sheet
- A3
- of
- Checked by:
- Approved by:
- Vu Pham
- Revision:
- Document No:
- V1.3.0
- Size:
- Date:

### Library data of the parts
C59-C64 = CM: CL10B224KA8NNNC; Value: 103
D10-D33 = Diode SMD: Code - JEDEC: DO-214-AB; Value: 1N5007; Published: 8-Jun-2000; Revision: July-2002: Re-released for DXP Platform.; Publisher: Altium Limited
LD1-LD24 = LD: OPV302; pin to pad: 3>2
R34-R39 = Res-SMD: as R5 on sheet CURRENT_SOURCE; Published: 08/06/2000; Publisher: Altium Hobart Technology Centre

## Nets that join several sheets
12V_EXP: POWER SWITCH AND LDO (6 pins), COMMUNICATION (J2.1 J3.1), CURRENT_SOURCE (8 pins), SWITCHING (6 pins)
+3.3: POWER SWITCH AND LDO (5 pins), COMMUNICATION (J3.4), CURRENT_SOURCE (11 pins), SWITCHING (6 pins)
+5: POWER SWITCH AND LDO (11 pins), CURRENT_SOURCE (6 pins)
GND: POWER SWITCH AND LDO (17 pins), COMMUNICATION (19 pins), CURRENT_SOURCE (31 pins), SWITCHING (59 pins)
I_LD_EXT: COMMUNICATION (D9.1 D9.3 J3.3), CURRENT_SOURCE (R31.1)
I_LD_INT: CURRENT_SOURCE (R17.1), SWITCHING (24 pins)
DAC_CS: COMMUNICATION (D5.3 J2.6), CURRENT_SOURCE (R5.1 U3.3)
I_MO_EXT: COMMUNICATION (D2.1 D2.3 J2.11), CURRENT_SOURCE (C50.2 R22.2)
I_MO_INT: COMMUNICATION (D3.3 J2.10), CURRENT_SOURCE (C29.2 R6.2)
LATCH: COMMUNICATION (D4.1 J2.7), CURRENT_SOURCE (R13.2 U3.8)
MOSI_LD: COMMUNICATION (5 pins), CURRENT_SOURCE (U3.5), SWITCHING (U8.3)
SCK_LD: COMMUNICATION (5 pins), CURRENT_SOURCE (U3.4), SWITCHING (U8.1 U9.1 U10.1)
SW_INT_CS: COMMUNICATION (D4.3 J2.8 TP4.1), SWITCHING (U8.24 U9.24 U10.24)